# EAGLE design blinkycircuitpcb (EAGLE 9.1.3)
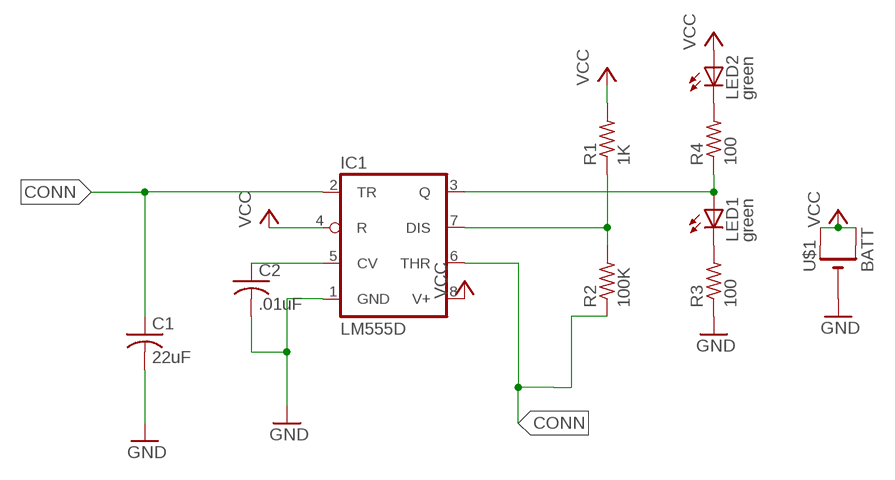
[diagram p0: schematic, sheet 1]

## Parts
C1  22uF  C-USC0805K  [C0805K]
C2  .01uF  C-USC0805K  [C0805K]
IC1  LM555D  [SO08]
LED1  green  LEDCHIPLED_0805  [CHIPLED_0805]
LED2  green  LEDCHIPLED_0805  [CHIPLED_0805]
R1  1K  R-US_R0805  [R0805]
R2  100K  R-US_R0805  [R0805]
R3  100  R-US_R0805  [R0805]
R4  100  R-US_R0805  [R0805]
U$1  BATT  CR1220SMT  [CR1220-SMD]

## Nets
CONN: C1.1 IC1.2(TR) IC1.6(THR) R2.1
GND: C1.2 C2.2 IC1.1(GND) R3.1 U$1.-
N$1: C2.1 IC1.5(CV)
N$3: LED1.C R3.2
N$4: LED2.C R4.2
N$5: IC1.3(Q) LED1.A R4.1
N$9: IC1.7(DIS) R1.1 R2.2
VCC: IC1.4(R) IC1.8(V+) LED2.A R1.2 U$1.+$1(+) U$1.+$2(+1)

## Library data of the parts
C1 C2 = adafruit:C-US: CAPACITOR, American symbol
IC1 = linear:*555: TIMER
LED1 LED2 = adafruit:LED: LED OSRAM: - CHIPLED LG R971, LG N971, LY N971, LG Q971, LY Q971, LO R971, LY R971 LH N974, LH R974 LS Q976, LO Q976, LY Q976 LO Q996 - Hyper CHIPLED LW Q18S LB Q993, LB Q99A, LB R99A - SideLED LS A670, LO A670, LY A670, LG A670, LP A670 LB A673, LV A673, LT A673, LW A673 LH A674 LY A675 LS A676, LA A676, LO A676, LY A676, LW A676 LS A679, LY A679, LG A679 - Hyper Micro SIDELED® LS Y876, LA Y876, LO Y876, LY Y876 LT Y87S - SmartLED LW L88C, LW L88S LB L89C, LB L89S, LG L890 LS L89K, LO L89K, LY L89K LS L896, LA L896, LO L896, LY L896 - TOPLED LS T670, LO T670, LY T670, LG T670, LP T670 LSG T670, LSP T670, LSY T670, LOP T670, LYG T670 LG T671, LOG T671, LSG T671 LB T673, LV T673, LT T673, LW T673 LH T674 LS T676, LA T676, LO T676, LY T676, LB T676, LH T676, LSB T676, LW T676 LB T67C, LV T67C, LT T67C, LS T67K, LO T67K, LY T67K, LW E67C LS E67B, LA E67B, LO E67B, LY E67B, LB E67C, LV E67C, LT E67C LW T67C LS T679, LY T679, LG T679 LS T770, LO T770, LY T770, LG T770, LP T770 LB T773, LV T773, LT T773, LW T773 LH T774 LS E675, LA E675, LY E675, LS T675 LS T776, LA T776, LO T776, LY T776, LB T776 LHGB T686 LT T68C, LB T68C - Hyper Mini TOPLED® LB M676 - Mini TOPLED Santana® LG M470 LS M47K, LO M47K, LY M47K Source: http://www.osram.convergy.de/
R1-R4 = adafruit:R-US_: RESISTOR, American symbol
U$1 = adafruit:CR1220: CR1216/CR1220/CR1225 12mm 3V lithium coin cell Great for battery packup. Both SMT and THM holders. Note the THM package has the ground pads on both sides of the PCB so that the masks are the same - this reduces the cost

## Board
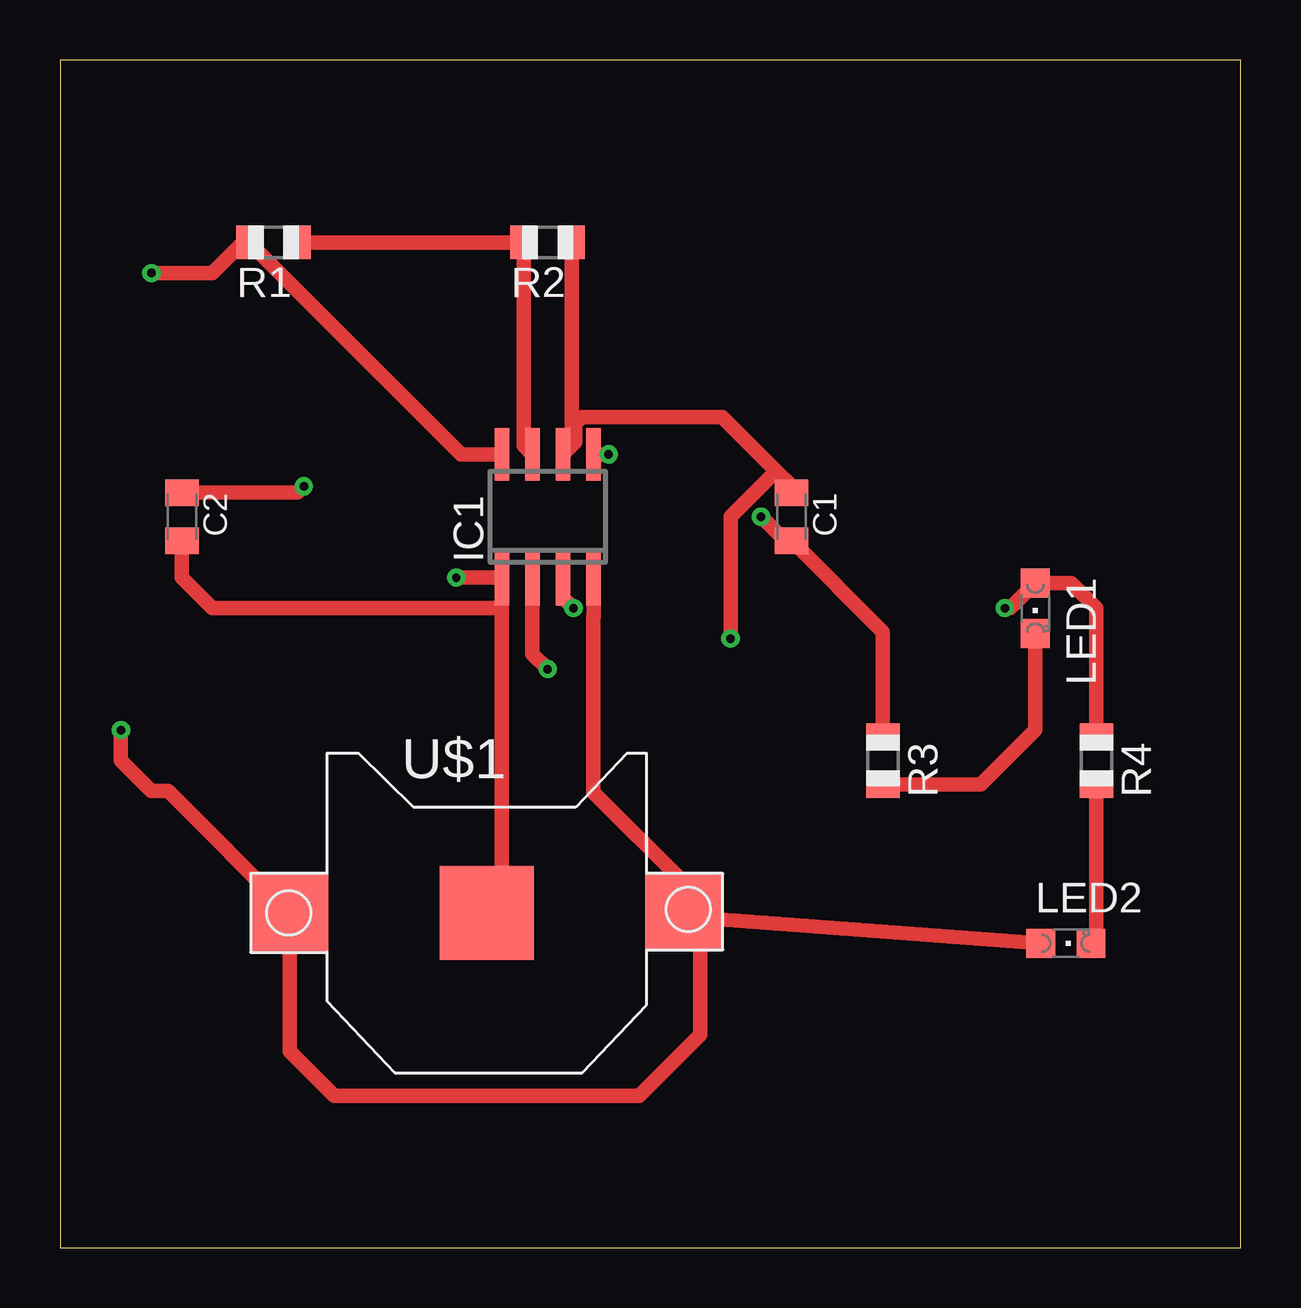
[diagram p1: board, top side]
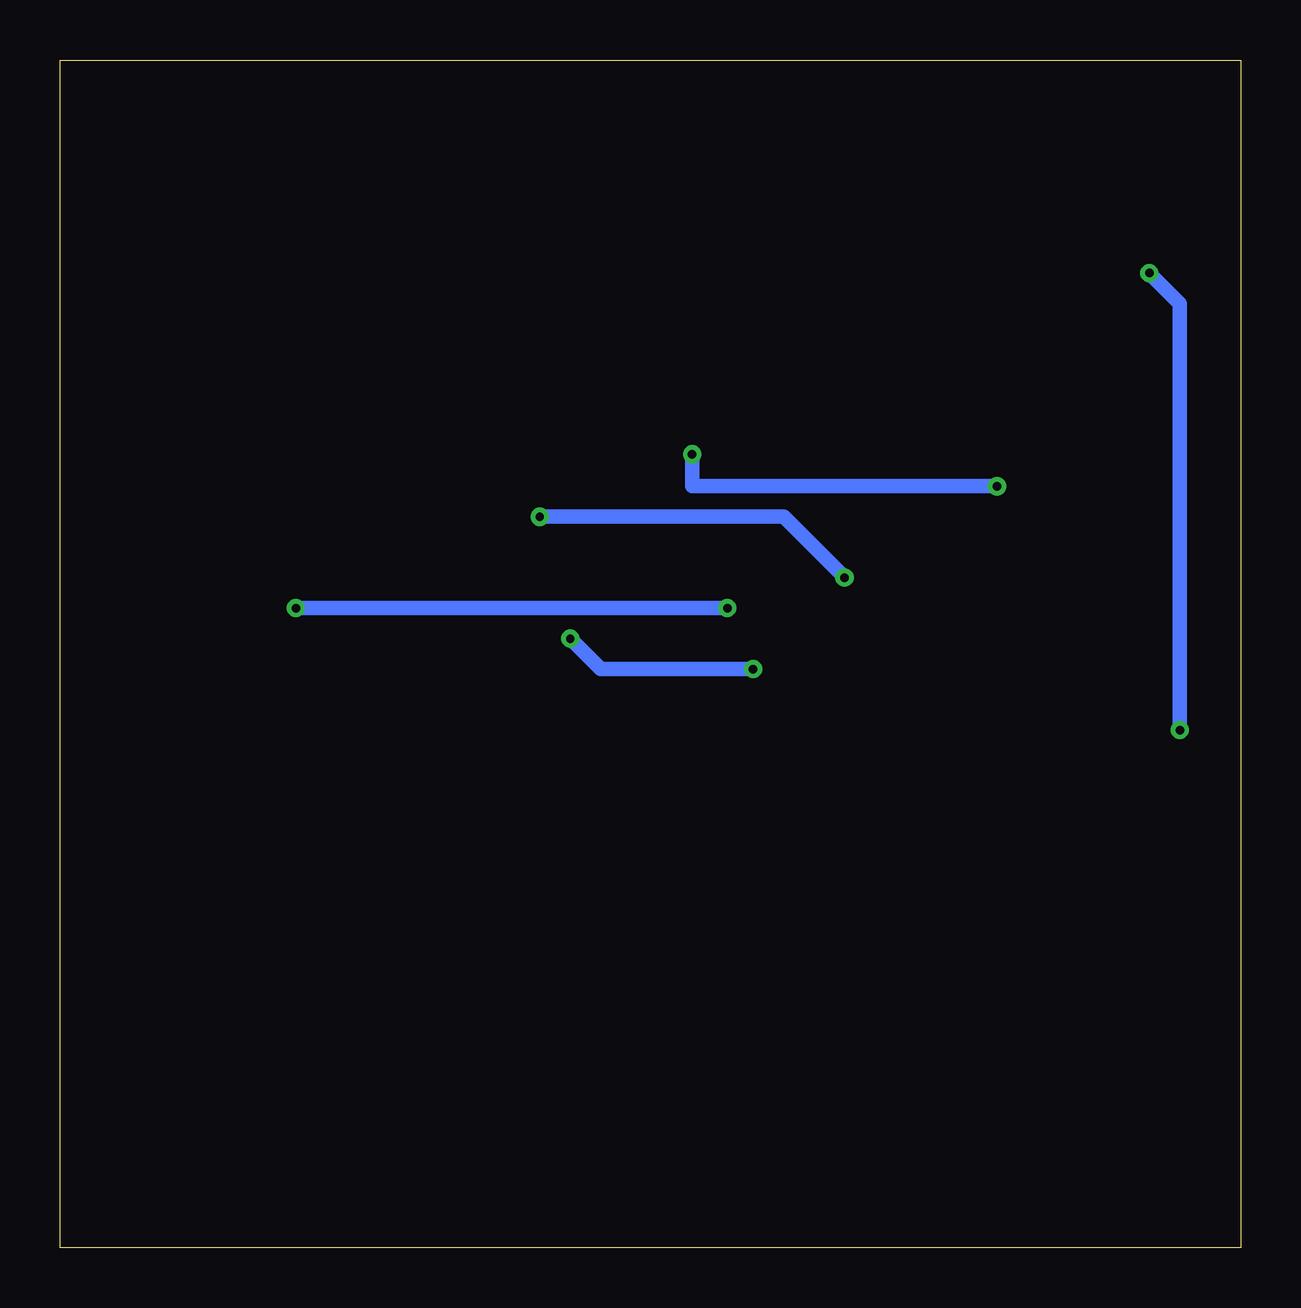
[diagram p2: board, bottom side, seen from below]

Size 49.2 x 49.52 mm. Coordinates in mm from the lower left corner, seen from the top.
Outline: 0,0 49.2,0 49.2,49.52 0,49.52 0,0
Copper layers (1*16): Top 0.035mm / dielectric 1.5mm / Bottom 0.035mm
Design rules "default": minimum track width 6mil, minimum drill 0.35mm, track to track 6mil, track to pad 6mil, pad to pad 6mil, via to via 6mil, smd to smd 6mil, copper to edge 40mil, drill to drill 6mil, minimum pad ring 10mil, minimum via ring 8mil, stop-mask expansion 4mil, vias tented up to drill 0mil, thermal gap 10mil

### Footprints (pad centres in the part's own frame; a part is rotated, then mirrored left to right if it is on the bottom)
C0805K = smd 1.1 x 1.4: 1 -1,0; 2 1,0
SO08 = smd 0.6 x 2.2: 1 -1.905,-2.6; 2 -0.635,-2.6; 3 0.635,-2.6; 4 1.905,-2.6; 5 1.905,2.6; 6 0.635,2.6; 7 -0.635,2.6; 8 -1.905,2.6
CHIPLED_0805 = smd 1.2 x 1.2: A 0,-1.05; C 0,1.05
R0805 = smd 1.1 x 1.4: 1 -1,0; 2 1,0
CR1220-SMD = smd 3.2 x 3.2: +$1 -8.2,0; +$2 8.2,0 | smd 3.9 x 3.9: - 0,0

### Placement (x,y rotation side)
C1  30.48,30.48 270 top
C2  5.08,30.48 270 top
IC1  20.32,30.48 0 top
LED1  40.64,26.67 180 top
LED2  41.91,12.7 270 top
R1  8.89,41.91 180 top
R2  20.32,41.91 180 top
R3  34.29,20.32 270 top
R4  43.18,20.32 270 top
U$1  17.78,13.97 0 top

### Tracks (layer width: path | path; a pad name or v marks a point on that pad's centre or on a via)
CONN  (via drill 0.35)
  Top 0.61: R2.1 21.32,33.45 | 21.32,33.45 IC1.6 | C1.1 30.48,31.75 29.84,32.38 | 21.32,33.45 21.47,33.59 21.47,34.37 21.74,34.64 27.59,34.64 29.84,32.38 | IC1.2 19.68,24.77 v20.32,24.13 | v27.94,25.4 27.94,30.48 29.84,32.38
  Bottom 0.61: v20.32,24.13 26.67,24.13 v27.94,25.4
GND  (via drill 0.35)
  Top 0.61: U$1.- 18.41,14.61 18.41,26.67 | 18.41,26.67 IC1.1 18.36,27.94 v16.51,27.94 | C2.2 5.08,27.94 6.35,26.67 18.41,26.67 | R3.1 34.29,25.67 C1.2 30.21,29.48 v29.21,30.48
  Bottom 0.61: v16.51,27.94 19.05,30.48 v29.21,30.48
N$1  (via drill 0.35)
  Top 0.61: v22.86,33.08 IC1.5 | C2.1 9.89,31.48 v10.16,31.75
  Bottom 0.61: v10.16,31.75 22.86,31.75 v22.86,33.08
N$3
  Top 0.61: R3.2 38.37,19.32 40.64,21.59 LED1.C
N$4
  Top 0.61: LED2.C 43.18,12.92 R4.2
N$5  (via drill 0.35)
  Top 0.61: IC1.3 20.95,27.11 v21.39,26.67 | R4.1 43.18,26.67 42.13,27.72 LED1.A 39.59,26.67 v39.37,26.67
  Bottom 0.61: v21.39,26.67 v39.37,26.67
N$9
  Top 0.61: IC1.7 19.32,33.45 R2.2 R1.1
VCC  (via drill 0.35)
  Top 0.61: 26.67,13.75 26.2,13.75 U$1.+$2 25.98,15.24 22.23,19 22.23,26.32 22.23,27.02 IC1.4 | 26.67,13.75 LED2.A | 18.41,33.38 IC1.8 17.78,33.08 17.74,33.08 16.72,33.08 R1.2 7.62,41.91 6.35,40.64 v3.81,40.64 | 26.67,13.75 26.67,8.89 24.13,6.35 11.43,6.35 9.58,8.2 U$1.+$1 4.5,19.05 3.81,19.05 2.54,20.32 v2.54,21.59
  Bottom 0.61: v3.81,40.64 2.54,39.37 v2.54,21.59